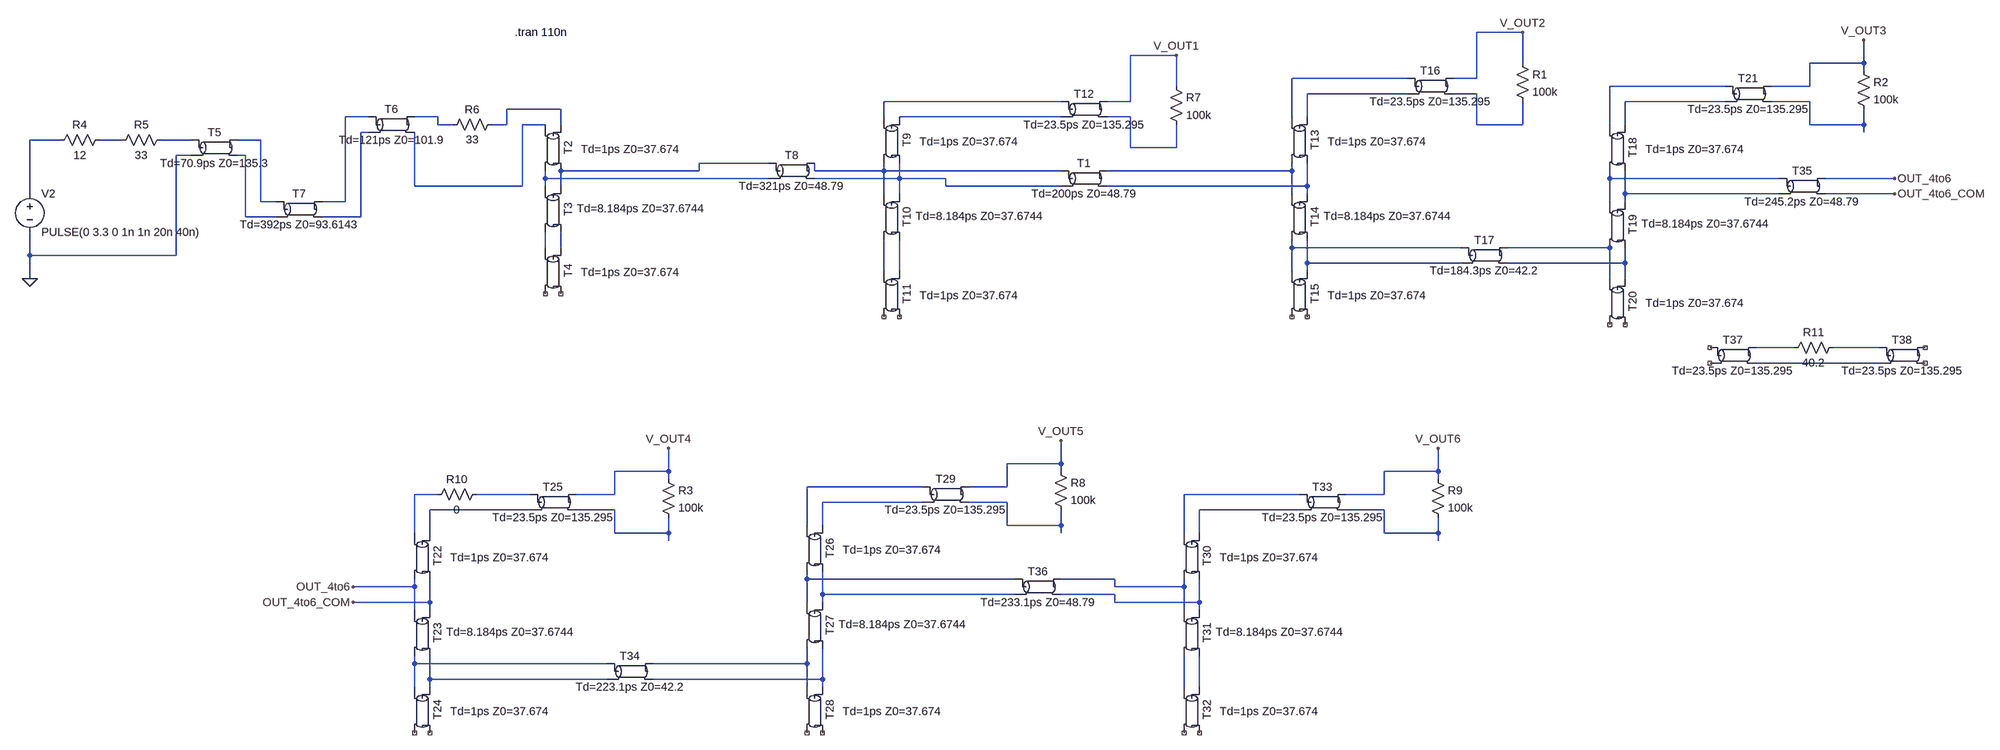
[diagram p0: schematic TDM_TransmissionLine_singleterm.asc]
TDM_TransmissionLine_singleterm.asc, the LTspice schematic file:
Version 4
SHEET 1 6036 1900
WIRE 2448 272 2352 272
WIRE 1728 320 1632 320
WIRE 2448 336 2448 272
WIRE 3232 336 3232 288
WIRE 3232 336 3120 336
WIRE 3232 352 3232 336
WIRE 2208 368 1968 368
WIRE 2352 368 2352 272
WIRE 2352 368 2304 368
WIRE 1728 384 1728 320
WIRE 2944 384 2704 384
WIRE 3120 384 3120 336
WIRE 3120 384 3040 384
WIRE 2208 400 2000 400
WIRE 2352 400 2304 400
WIRE 1488 416 1120 416
WIRE 1632 416 1632 320
WIRE 1632 416 1584 416
WIRE 2944 416 2736 416
WIRE 3120 416 3040 416
WIRE 448 432 336 432
WIRE 48 448 0 448
WIRE 192 448 144 448
WIRE 1120 448 1120 416
WIRE 1488 448 1152 448
WIRE 1632 448 1584 448
WIRE 1968 448 1968 368
WIRE 2000 448 2000 400
WIRE 192 464 192 448
WIRE 224 464 192 464
WIRE 336 464 336 432
WIRE 336 464 304 464
WIRE 416 464 368 464
WIRE 448 464 448 432
WIRE 2352 464 2352 400
WIRE 2448 464 2448 416
WIRE 2448 464 2352 464
WIRE 2704 464 2704 384
WIRE 2736 464 2736 416
WIRE 3120 464 3120 416
WIRE 3232 464 3232 432
WIRE 3232 464 3120 464
WIRE 48 480 32 480
WIRE 3232 480 3232 464
WIRE -592 496 -656 496
WIRE -464 496 -512 496
WIRE -320 496 -384 496
WIRE -176 496 -224 496
WIRE 1632 512 1632 448
WIRE 1728 512 1728 464
WIRE 1728 512 1632 512
WIRE -320 528 -352 528
WIRE -208 528 -224 528
WIRE 880 544 736 544
WIRE 736 560 736 544
WIRE 736 560 448 560
WIRE 976 560 976 544
WIRE 1120 560 1120 544
WIRE 1120 560 976 560
WIRE 1488 560 1120 560
WIRE 1968 560 1968 544
WIRE 1968 560 1584 560
WIRE 416 576 416 560
WIRE 880 576 416 576
WIRE 1152 576 1152 544
WIRE 1152 576 976 576
WIRE 1248 576 1152 576
WIRE 2704 576 2704 560
WIRE 3056 576 2704 576
WIRE 3296 576 3152 576
WIRE 144 592 144 480
WIRE 368 592 368 464
WIRE 368 592 144 592
WIRE 416 592 416 576
WIRE 448 592 448 560
WIRE 1248 592 1248 576
WIRE 1488 592 1248 592
WIRE 2000 592 2000 544
WIRE 2000 592 1584 592
WIRE -656 608 -656 496
WIRE 1120 608 1120 560
WIRE 1152 608 1152 576
WIRE 1968 608 1968 560
WIRE 2000 608 2000 592
WIRE 2736 608 2736 560
WIRE 3056 608 2736 608
WIRE 3296 608 3152 608
WIRE -176 624 -176 496
WIRE -144 624 -176 624
WIRE 0 624 0 448
WIRE 0 624 -48 624
WIRE 2704 624 2704 576
WIRE 2736 624 2736 608
WIRE -208 656 -208 528
WIRE -144 656 -208 656
WIRE 32 656 32 480
WIRE 32 656 -48 656
WIRE 416 720 416 688
WIRE 448 720 448 688
WIRE 1968 720 1968 704
WIRE 2320 720 1968 720
WIRE 2704 720 2416 720
WIRE -656 736 -656 688
WIRE -352 736 -352 528
WIRE -352 736 -656 736
WIRE 2000 752 2000 704
WIRE 2320 752 2000 752
WIRE 2736 752 2736 720
WIRE 2736 752 2416 752
WIRE 1120 768 1120 704
WIRE 1152 768 1152 704
WIRE 1968 768 1968 720
WIRE 2000 768 2000 752
WIRE -656 784 -656 736
WIRE 2704 784 2704 720
WIRE 2736 784 2736 752
WIRE 3088 928 3008 928
WIRE 3264 928 3168 928
WIRE 3264 960 3008 960
WIRE 1488 1216 1488 1168
WIRE 1488 1216 1376 1216
WIRE 672 1232 672 1184
WIRE 672 1232 560 1232
WIRE 1488 1232 1488 1216
WIRE 2272 1232 2272 1184
WIRE 2272 1232 2160 1232
WIRE 672 1248 672 1232
WIRE 2272 1248 2272 1232
WIRE 1200 1264 960 1264
WIRE 1376 1264 1376 1216
WIRE 1376 1264 1296 1264
WIRE 192 1280 144 1280
WIRE 384 1280 272 1280
WIRE 560 1280 560 1232
WIRE 560 1280 480 1280
WIRE 1984 1280 1744 1280
WIRE 2160 1280 2160 1232
WIRE 2160 1280 2080 1280
WIRE 1200 1296 992 1296
WIRE 1376 1296 1296 1296
WIRE 384 1312 176 1312
WIRE 560 1312 480 1312
WIRE 1984 1312 1776 1312
WIRE 2160 1312 2080 1312
WIRE 960 1344 960 1264
WIRE 992 1344 992 1296
WIRE 1376 1344 1376 1296
WIRE 1488 1344 1488 1312
WIRE 1488 1344 1376 1344
WIRE 144 1360 144 1280
WIRE 176 1360 176 1312
WIRE 560 1360 560 1312
WIRE 672 1360 672 1328
WIRE 672 1360 560 1360
WIRE 1488 1360 1488 1344
WIRE 1744 1360 1744 1280
WIRE 1776 1360 1776 1312
WIRE 2160 1360 2160 1312
WIRE 2272 1360 2272 1328
WIRE 2272 1360 2160 1360
WIRE 672 1376 672 1360
WIRE 2272 1376 2272 1360
WIRE 960 1456 960 1440
WIRE 1392 1456 960 1456
WIRE 1600 1456 1488 1456
WIRE 144 1472 144 1456
WIRE 144 1472 16 1472
WIRE 1600 1472 1600 1456
WIRE 1744 1472 1744 1456
WIRE 1744 1472 1600 1472
WIRE 992 1488 992 1440
WIRE 1392 1488 992 1488
WIRE 1600 1488 1488 1488
WIRE 176 1504 176 1456
WIRE 176 1504 16 1504
WIRE 960 1504 960 1456
WIRE 992 1504 992 1488
WIRE 1600 1504 1600 1488
WIRE 1776 1504 1776 1456
WIRE 1776 1504 1600 1504
WIRE 144 1520 144 1472
WIRE 176 1520 176 1504
WIRE 1744 1520 1744 1472
WIRE 1776 1520 1776 1504
WIRE 144 1632 144 1616
WIRE 544 1632 144 1632
WIRE 960 1632 960 1600
WIRE 960 1632 640 1632
WIRE 176 1664 176 1616
WIRE 544 1664 176 1664
WIRE 992 1664 992 1600
WIRE 992 1664 640 1664
WIRE 144 1680 144 1632
WIRE 176 1680 176 1664
WIRE 960 1680 960 1632
WIRE 992 1680 992 1664
WIRE 1744 1680 1744 1616
WIRE 1776 1680 1776 1616
FLAG -656 784 0
FLAG 1728 320 V_OUT1
FLAG 2448 272 V_OUT2
FLAG 3232 288 V_OUT3
FLAG 672 1184 V_OUT4
FLAG 1488 1168 V_OUT5
FLAG 2272 1184 V_OUT6
FLAG 3296 576 OUT_4to6
FLAG 16 1472 OUT_4to6
FLAG 3296 608 OUT_4to6_COM
FLAG 16 1504 OUT_4to6_COM
SYMBOL tline 432 512 R90
WINDOW 3 19 -161 VBottom 2
SYMATTR Value Td=1ps Z0=37.674
SYMATTR InstName T2
SYMBOL tline 432 640 R90
WINDOW 3 14 -183 VBottom 2
SYMATTR Value Td=8.184ps Z0=37.6744
SYMATTR InstName T3
SYMBOL tline 432 768 R90
WINDOW 3 19 -161 VBottom 2
SYMATTR Value Td=1ps Z0=37.674
SYMATTR InstName T4
SYMBOL voltage -656 592 R0
WINDOW 123 0 0 Left 0
WINDOW 39 0 0 Left 0
SYMATTR InstName V2
SYMATTR Value PULSE(0 3.3 0 1n 1n 20n 40n)
SYMBOL res -496 480 R90
WINDOW 0 0 56 VBottom 2
WINDOW 3 32 56 VTop 2
SYMATTR InstName R4
SYMATTR Value 12
SYMBOL res -368 480 R90
WINDOW 0 0 56 VBottom 2
WINDOW 3 32 56 VTop 2
SYMATTR InstName R5
SYMATTR Value 33
SYMBOL tline -272 512 R0
SYMATTR InstName T5
SYMATTR Value Td=70.9ps Z0=135.3
SYMBOL tline 96 464 R0
SYMATTR InstName T6
SYMATTR Value Td=121ps Z0=101.9
SYMBOL tline -96 640 R0
SYMATTR InstName T7
SYMATTR Value Td=392ps Z0=93.6143
SYMBOL tline 928 560 R0
SYMATTR InstName T8
SYMATTR Value Td=321ps Z0=48.79
SYMBOL tline 1136 496 R90
WINDOW 3 19 -161 VBottom 2
SYMATTR Value Td=1ps Z0=37.674
SYMATTR InstName T9
SYMBOL tline 1136 656 R90
WINDOW 3 14 -183 VBottom 2
SYMATTR Value Td=8.184ps Z0=37.6744
SYMATTR InstName T10
SYMBOL tline 1136 816 R90
WINDOW 3 19 -161 VBottom 2
SYMATTR Value Td=1ps Z0=37.674
SYMATTR InstName T11
SYMBOL tline 1536 432 R0
SYMATTR InstName T12
SYMATTR Value Td=23.5ps Z0=135.295
SYMBOL res 1712 368 R0
SYMATTR InstName R7
SYMATTR Value 100k
SYMBOL tline 1536 576 R0
SYMATTR InstName T1
SYMATTR Value Td=200ps Z0=48.79
SYMBOL tline 1984 496 R90
WINDOW 3 19 -161 VBottom 2
SYMATTR Value Td=1ps Z0=37.674
SYMATTR InstName T13
SYMBOL tline 1984 656 R90
WINDOW 3 14 -183 VBottom 2
SYMATTR Value Td=8.184ps Z0=37.6744
SYMATTR InstName T14
SYMBOL tline 1984 816 R90
WINDOW 3 19 -161 VBottom 2
SYMATTR Value Td=1ps Z0=37.674
SYMATTR InstName T15
SYMBOL tline 2256 384 R0
SYMATTR InstName T16
SYMATTR Value Td=23.5ps Z0=135.295
SYMBOL res 2432 320 R0
SYMATTR InstName R1
SYMATTR Value 100k
SYMBOL tline 2368 736 R0
SYMATTR InstName T17
SYMATTR Value Td=184.3ps Z0=42.2
SYMBOL tline 2720 512 R90
WINDOW 3 19 -161 VBottom 2
SYMATTR Value Td=1ps Z0=37.674
SYMATTR InstName T18
SYMBOL tline 2720 672 R90
WINDOW 3 14 -183 VBottom 2
SYMATTR Value Td=8.184ps Z0=37.6744
SYMATTR InstName T19
SYMBOL tline 2720 832 R90
WINDOW 3 19 -161 VBottom 2
SYMATTR Value Td=1ps Z0=37.674
SYMATTR InstName T20
SYMBOL tline 2992 400 R0
SYMATTR InstName T21
SYMATTR Value Td=23.5ps Z0=135.295
SYMBOL res 3216 336 R0
SYMATTR InstName R2
SYMATTR Value 100k
SYMBOL tline 160 1408 R90
WINDOW 3 19 -161 VBottom 2
SYMATTR Value Td=1ps Z0=37.674
SYMATTR InstName T22
SYMBOL tline 160 1568 R90
WINDOW 3 14 -183 VBottom 2
SYMATTR Value Td=8.184ps Z0=37.6744
SYMATTR InstName T23
SYMBOL tline 160 1728 R90
WINDOW 3 19 -161 VBottom 2
SYMATTR Value Td=1ps Z0=37.674
SYMATTR InstName T24
SYMBOL tline 432 1296 R0
SYMATTR InstName T25
SYMATTR Value Td=23.5ps Z0=135.295
SYMBOL res 656 1232 R0
SYMATTR InstName R3
SYMATTR Value 100k
SYMBOL tline 976 1392 R90
WINDOW 3 19 -161 VBottom 2
SYMATTR Value Td=1ps Z0=37.674
SYMATTR InstName T26
SYMBOL tline 976 1552 R90
WINDOW 3 14 -183 VBottom 2
SYMATTR Value Td=8.184ps Z0=37.6744
SYMATTR InstName T27
SYMBOL tline 976 1728 R90
WINDOW 3 19 -161 VBottom 2
SYMATTR Value Td=1ps Z0=37.674
SYMATTR InstName T28
SYMBOL tline 1248 1280 R0
SYMATTR InstName T29
SYMATTR Value Td=23.5ps Z0=135.295
SYMBOL res 1472 1216 R0
SYMATTR InstName R8
SYMATTR Value 100k
SYMBOL tline 1760 1408 R90
WINDOW 3 19 -161 VBottom 2
SYMATTR Value Td=1ps Z0=37.674
SYMATTR InstName T30
SYMBOL tline 1760 1568 R90
WINDOW 3 14 -183 VBottom 2
SYMATTR Value Td=8.184ps Z0=37.6744
SYMATTR InstName T31
SYMBOL tline 1760 1728 R90
WINDOW 3 19 -161 VBottom 2
SYMATTR Value Td=1ps Z0=37.674
SYMATTR InstName T32
SYMBOL tline 2032 1296 R0
SYMATTR InstName T33
SYMATTR Value Td=23.5ps Z0=135.295
SYMBOL res 2256 1232 R0
SYMATTR InstName R9
SYMATTR Value 100k
SYMBOL tline 592 1648 R0
SYMATTR InstName T34
SYMATTR Value Td=223.1ps Z0=42.2
SYMBOL tline 3104 592 R0
SYMATTR InstName T35
SYMATTR Value Td=245.2ps Z0=48.79
SYMBOL tline 1440 1472 R0
SYMATTR InstName T36
SYMATTR Value Td=233.1ps Z0=48.79
SYMBOL res 288 1264 R90
WINDOW 0 0 56 VBottom 2
WINDOW 3 32 56 VTop 2
SYMATTR InstName R10
SYMATTR Value 0
SYMBOL tline 2960 944 R0
SYMATTR InstName T37
SYMATTR Value Td=23.5ps Z0=135.295
SYMBOL tline 3312 944 R0
SYMATTR InstName T38
SYMATTR Value Td=23.5ps Z0=135.295
SYMBOL res 3184 912 R90
WINDOW 0 0 56 VBottom 2
WINDOW 3 32 56 VTop 2
SYMATTR InstName R11
SYMATTR Value 40.2
SYMBOL res 320 448 R90
WINDOW 0 0 56 VBottom 2
WINDOW 3 32 56 VTop 2
SYMATTR InstName R6
SYMATTR Value 33
TEXT 352 272 Left 2 !.tran 110n

The netlist it stands for:
* TDM_TransmissionLine_singleterm.asc
T2 N008 N013 N020 N023 Td=1ps Z0=37.674
T3 N020 N023 N029 N028 Td=8.184ps Z0=37.6744
T4 N029 N028 NC_01 NC_02 Td=1ps Z0=37.674
V2 N015 0 PULSE(0 3.3 0 1n 1n 20n 40n)
R4 N016 N015 12
R5 N017 N016 33
T5 N017 0 N018 N019 Td=70.9ps Z0=135.3
T6 N009 N014 N010 N013 Td=121ps Z0=101.9
T7 N018 N019 N009 N014 Td=392ps Z0=93.6143
T8 N020 N023 N021 N024 Td=321ps Z0=48.79
T9 N011 N005 N024 N021 Td=1ps Z0=37.674
T10 N024 N021 N035 N034 Td=8.184ps Z0=37.6744
T11 N035 N034 NC_03 NC_04 Td=1ps Z0=37.674
T12 N005 N011 V_OUT1 N012 Td=23.5ps Z0=135.295
R7 V_OUT1 N012 100k
T1 N021 N024 N022 N026 Td=200ps Z0=48.79
T13 N003 N001 N026 N022 Td=1ps Z0=37.674
T14 N026 N022 N032 N030 Td=8.184ps Z0=37.6744
T15 N032 N030 NC_05 NC_06 Td=1ps Z0=37.674
T16 N001 N003 V_OUT2 N004 Td=23.5ps Z0=135.295
R1 V_OUT2 N004 100k
T17 N030 N032 N031 N033 Td=184.3ps Z0=42.2
T18 N006 N002 N027 N025 Td=1ps Z0=37.674
T19 N027 N025 N033 N031 Td=8.184ps Z0=37.6744
T20 N033 N031 NC_07 NC_08 Td=1ps Z0=37.674
T21 N002 N006 V_OUT3 N007 Td=23.5ps Z0=135.295
R2 V_OUT3 N007 100k
T22 N045 N040 OUT_4to6_COM OUT_4to6 Td=1ps Z0=37.674
T23 OUT_4to6_COM OUT_4to6 N055 N053 Td=8.184ps Z0=37.6744
T24 N055 N053 NC_09 NC_10 Td=1ps Z0=37.674
T25 N041 N045 V_OUT4 N046 Td=23.5ps Z0=135.295
R3 V_OUT4 N046 100k
T26 N043 N039 N051 N049 Td=1ps Z0=37.674
T27 N051 N049 N056 N054 Td=8.184ps Z0=37.6744
T28 N056 N054 NC_11 NC_12 Td=1ps Z0=37.674
T29 N039 N043 V_OUT5 N044 Td=23.5ps Z0=135.295
R8 V_OUT5 N044 100k
T30 N047 N042 N052 N050 Td=1ps Z0=37.674
T31 N052 N050 N058 N057 Td=8.184ps Z0=37.6744
T32 N058 N057 NC_13 NC_14 Td=1ps Z0=37.674
T33 N042 N047 V_OUT6 N048 Td=23.5ps Z0=135.295
R9 V_OUT6 N048 100k
T34 N053 N055 N054 N056 Td=223.1ps Z0=42.2
T35 N025 N027 OUT_4to6 OUT_4to6_COM Td=245.2ps Z0=48.79
T36 N049 N051 N050 N052 Td=233.1ps Z0=48.79
R10 N041 N040 0
T37 NC_15 NC_16 N036 N038 Td=23.5ps Z0=135.295
T38 N037 N038 NC_17 NC_18 Td=23.5ps Z0=135.295
R11 N037 N036 40.2
R6 N008 N010 33
.tran 110n
.backanno
.end